# Altium schematic sheet LTEW_nRF9160.SchDoc: LTEW_nRF9160
size 420 x 297 mm; Organization: MSE HES-SO; Address1: HEVS; Address3: Tristan Traiber; DocumentNumber: 2; Revision: 1.0; SheetNumber: 2; SheetTotal: 6; Author: Tristan Traiber; DrawnBy: Tristan Traiber; Engineer: Tristan Traiber; DocumentSize: A3
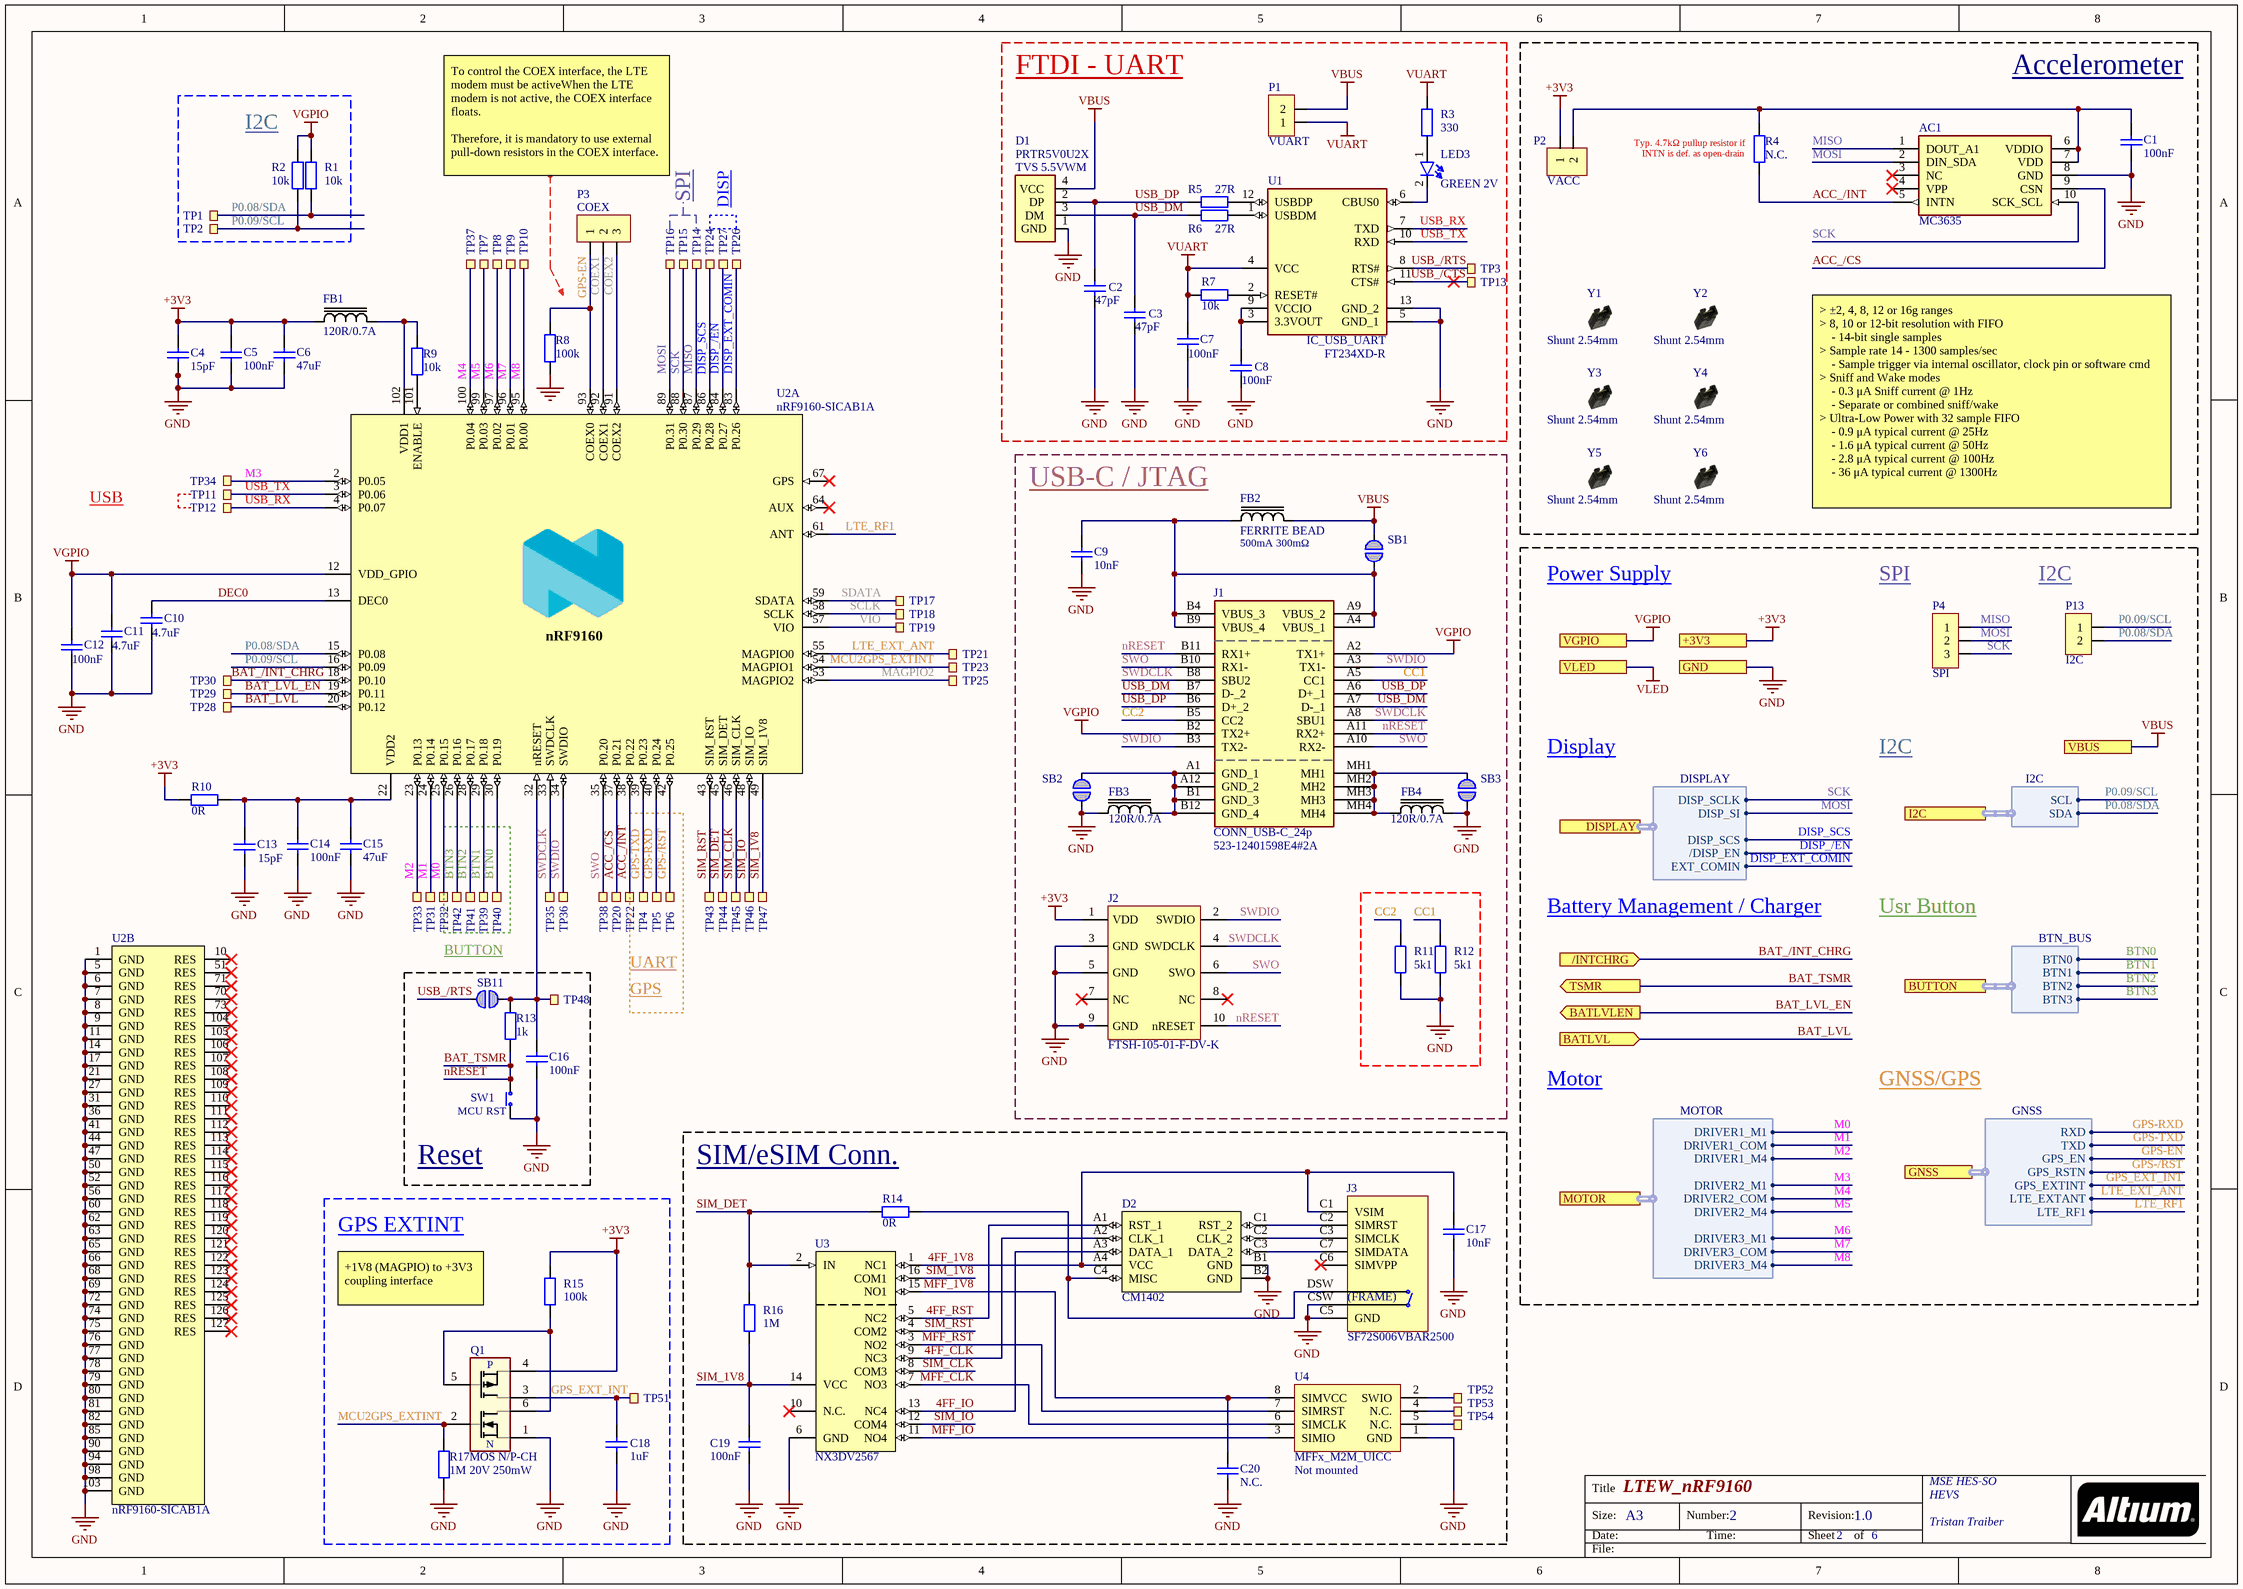
[diagram p0: LTEW_nRF9160.SchDoc]

## Parts
AC1  MC3635  [MC3635]
C1  100nF  [C0603]
C2  47pF  [C0603]
C3  47pF  [C0603]
C4  15pF  [C0603]
C5  100nF  [C0603]
C6  47uF  [CAPC2012X11L]
C7  100nF  [C0603]
C8  100nF  [C0603]
C9  10nF  [C0603]
C10  4.7uF  [C0603]
C11  4.7uF  [C0603]
C12  100nF  [C0603]
C13  15pF  [C0603]
C14  100nF  [C0603]
C15  47uF  [CAPC2012X11L]
C16  100nF  [C0603]
C17  10nF  [C0603]
C18  1uF  [C0603]
C19  100nF  [C0603]
C20  N.C.  [C0603]
D1  TVS 5.5VWM  [PRTR5V0U2X]
D2  CM1402  [CM1402]
FB1  120R/0.7A  [INDC1005X04L]
FB2  FERRITE BEAD  value 500mA 300mΩ  [BEADC2012X110N]
FB3  120R/0.7A  [INDC1005X04L]
FB4  120R/0.7A  [INDC1005X04L]
J1  CONN_USB-C_24p  Supplier Part Number 1: 523-12401598E4#2A  [12401598E42A - JTAG]
J2  FTSH-105-01-F-DV-K  [HDR_2x5-SMD-1.27mm-K]
J3  SF72S006VBAR2500  [SF72S006VBAR2500]
LED3  GREEN 2V  [LEDC1608X80N]
P1  VUART  [HDR1X2 - UART]
P2  VACC  [HDR1X2 - ACCEL]
P3  COEX  [HDR1X3 - COEX]
P4  SPI  [HDR1X3 - SPI]
P13  I2C  [HDR1X2 - I2C]
Q1  MOS N/P-CH  value 20V 250mW  [SOT50P160X60-6N]
R1  10k  [RES0603]
R2  10k  [RES0603]
R3  330  [RES0603]
R4  N.C.  [RES0603]
R5  27R  [RES0603]
R6  27R  [RES0603]
R7  10k  [RES0603]
R8  100k  [RES0603]
R9  10k  [RES0603]
R10  0R  [RESC2012X60N]
R11  5k1  [RES0603]
R12  5k1  [RES0603]
R13  1k  [RES0603]
R14  0R  [RESC2012X60N]
R15  100k  [RES0603]
R16  1M  [RES0603]
R17  1M  [RES0603]
SB1  Solderbridge  [Solderbridge]  (value not drawn)  (no BOM)
SB2  Solderbridge  [Solderbridge]  (value not drawn)  (no BOM)
SB3  Solderbridge  [Solderbridge]  (value not drawn)  (no BOM)
SB11  Solderbridge  [Solderbridge]  (value not drawn)  (no BOM)
SW1  value MCU RST  [Push Button C2.5X3.0 OMRON B3U-1000P(M)-B - MCU RST]  (hidden comment: SKHUALE010)
TP1  Ø1.0mm,SMD  [TP_SMD_Ø0.8mm]  (value not drawn)  (no BOM)
TP2  Ø1.0mm,SMD  [TP_SMD_Ø0.8mm]  (value not drawn)  (no BOM)
TP3  Ø1.0mm,SMD  [TP_SMD_Ø0.8mm]  (value not drawn)  (no BOM)
TP4  Ø1.0mm,SMD  [TP_SMD_Ø0.8mm]  (value not drawn)  (no BOM)
TP5  Ø1.0mm,SMD  [TP_SMD_Ø0.8mm]  (value not drawn)  (no BOM)
TP6  Ø1.0mm,SMD  [TP_SMD_Ø0.8mm]  (value not drawn)  (no BOM)
TP7  Ø1.0mm,SMD  [TP_SMD_Ø0.8mm]  (value not drawn)  (no BOM)
TP8  Ø1.0mm,SMD  [TP_SMD_Ø0.8mm]  (value not drawn)  (no BOM)
TP9  Ø1.0mm,SMD  [TP_SMD_Ø0.8mm]  (value not drawn)  (no BOM)
TP10  (no value)  [TP_SMD_Ø0.8mm]  (no BOM)
TP11  Ø1.0mm,SMD  [TP_SMD_Ø0.8mm]  (value not drawn)  (no BOM)
TP12  Ø1.0mm,SMD  [TP_SMD_Ø0.8mm]  (value not drawn)  (no BOM)
TP13  Ø1.0mm,SMD  [TP_SMD_Ø0.8mm]  (value not drawn)  (no BOM)
TP14  Ø1.0mm,SMD  [TP_SMD_Ø0.8mm]  (value not drawn)  (no BOM)
TP15  Ø1.0mm,SMD  [TP_SMD_Ø0.8mm]  (value not drawn)  (no BOM)
TP16  Ø1.0mm,SMD  [TP_SMD_Ø0.8mm]  (value not drawn)  (no BOM)
TP17  Ø1.0mm,SMD  [TP_SMD_Ø0.8mm]  (value not drawn)  (no BOM)
TP18  Ø1.0mm,SMD  [TP_SMD_Ø0.8mm]  (value not drawn)  (no BOM)
TP19  Ø1.0mm,SMD  [TP_SMD_Ø0.8mm]  (value not drawn)  (no BOM)
TP20  Ø1.0mm,SMD  [TP_SMD_Ø0.8mm]  (value not drawn)  (no BOM)
TP21  Ø1.0mm,SMD  [TP_SMD_Ø0.8mm]  (value not drawn)  (no BOM)
TP22  Ø1.0mm,SMD  [TP_SMD_Ø0.8mm]  (value not drawn)  (no BOM)
TP23  Ø1.0mm,SMD  [TP_SMD_Ø0.8mm]  (value not drawn)  (no BOM)
TP24  Ø1.0mm,SMD  [TP_SMD_Ø0.8mm]  (value not drawn)  (no BOM)
TP25  Ø1.0mm,SMD  [TP_SMD_Ø0.8mm]  (value not drawn)  (no BOM)
TP26  Ø1.0mm,SMD  [TP_SMD_Ø0.8mm]  (value not drawn)  (no BOM)
TP27  Ø1.0mm,SMD  [TP_SMD_Ø0.8mm]  (value not drawn)  (no BOM)
TP28  Ø1.0mm,SMD  [TP_SMD_Ø0.8mm]  (value not drawn)  (no BOM)
TP29  Ø1.0mm,SMD  [TP_SMD_Ø0.8mm]  (value not drawn)  (no BOM)
TP30  Ø1.0mm,SMD  [TP_SMD_Ø0.8mm]  (value not drawn)  (no BOM)
TP31  Ø1.0mm,SMD  [TP_SMD_Ø0.8mm]  (value not drawn)  (no BOM)
TP32  Ø1.0mm,SMD  [TP_SMD_Ø0.8mm]  (value not drawn)  (no BOM)
TP33  Ø1.0mm,SMD  [TP_SMD_Ø0.8mm]  (value not drawn)  (no BOM)
TP34  Ø1.0mm,SMD  [TP_SMD_Ø0.8mm]  (value not drawn)  (no BOM)
TP35  Ø1.0mm,SMD  [TP_SMD_Ø0.8mm]  (value not drawn)  (no BOM)
TP36  Ø1.0mm,SMD  [TP_SMD_Ø0.8mm]  (value not drawn)  (no BOM)
TP37  Ø1.0mm,SMD  [TP_SMD_Ø0.8mm]  (value not drawn)  (no BOM)
TP38  Ø1.0mm,SMD  [TP_SMD_Ø0.8mm]  (value not drawn)  (no BOM)
TP39  Ø1.0mm,SMD  [TP_SMD_Ø0.8mm]  (value not drawn)  (no BOM)
TP40  Ø1.0mm,SMD  [TP_SMD_Ø0.8mm]  (value not drawn)  (no BOM)
TP41  Ø1.0mm,SMD  [TP_SMD_Ø0.8mm]  (value not drawn)  (no BOM)
TP42  Ø1.0mm,SMD  [TP_SMD_Ø0.8mm]  (value not drawn)  (no BOM)
TP43  Ø1.0mm,SMD  [TP_SMD_Ø0.8mm]  (value not drawn)  (no BOM)
TP44  Ø1.0mm,SMD  [TP_SMD_Ø0.8mm]  (value not drawn)  (no BOM)
TP45  Ø1.0mm,SMD  [TP_SMD_Ø0.8mm]  (value not drawn)  (no BOM)
TP46  Ø1.0mm,SMD  [TP_SMD_Ø0.8mm]  (value not drawn)  (no BOM)
TP47  Ø1.0mm,SMD  [TP_SMD_Ø0.8mm]  (value not drawn)  (no BOM)
TP48  Ø1.0mm,SMD  [TP_SMD_Ø0.8mm]  (value not drawn)  (no BOM)
TP51  Ø1.0mm,SMD  [TP_SMD_Ø0.8mm]  (value not drawn)  (no BOM)
TP52  Ø1.0mm,SMD  [TP_SMD_Ø0.8mm]  (value not drawn)  (no BOM)
TP53  Ø1.0mm,SMD  [TP_SMD_Ø0.8mm]  (value not drawn)  (no BOM)
TP54  Ø1.0mm,SMD  [TP_SMD_Ø0.8mm]  (value not drawn)  (no BOM)
U1  IC_USB_UART  Manufacturer_Part_Number: FT234XD-R  [SON45P300X300X75-13N-D]
U2  nRF9160-SICAB1A  [LGA50P1600X1050X104-161N]  (parts A,B of 2)
U3  NX3DV2567  [XQFN40P180X260X50-16N]
U4  MFFx_M2M_UICC  Assembly: Not mounted  [SON127P600X90_HS-8N]
Y1  Shunt 2.54mm  [Shunt_2.54mm_Horizontal]
Y2  Shunt 2.54mm  [Shunt_2.54mm_Horizontal]
Y3  Shunt 2.54mm  [Shunt_2.54mm_Horizontal]
Y4  Shunt 2.54mm  [Shunt_2.54mm_Horizontal]
Y5  Shunt 2.54mm  [Shunt_2.54mm_Horizontal]
Y6  Shunt 2.54mm  [Shunt_2.54mm_Horizontal]

## Blocks framed on the sheet
FTDI - UART: C2 C3 C7 C8 D1 LED3 P1 R3 R5-R7 TP3 TP13 U1
Accelerometer: AC1 C1 P2 R4 Y1-Y6
I2C: R1 R2 TP1 TP2
USB-C / JTAG: C9 FB2-FB4 J1 J2 R11 R12 SB1-SB3
Reset: C16 R13 SB11 SW1 TP48
SIM/eSIM Conn.: C17 C19 C20 D2 J3 R14 R16 TP52-TP54 U3 U4
GPS EXTINT: C18 Q1 R15 R17 TP51

## Ports
+3V3, /INTCHRG (in), BATLVL (in), BATLVLEN (out), BUTTON (harness BTN_BUS), DISPLAY (harness DISPLAY), GND, GNSS (harness GNSS), I2C (harness I2C), MOTOR (harness MOTOR), TSMR (out), VBUS, VGPIO, VLED

## Harnesses
I2C: SCL, SDA
BTN_BUS: BTN0, BTN1, BTN2, BTN3
GNSS: RXD, TXD, LTE_EXTANT, GPS_EN, LTE_RF1, GPS_RSTN, GPS_EXTINT
DISPLAY: DISP_SCLK, DISP_SCS, DISP_SI, /DISP_EN, EXT_COMIN
MOTOR: DRIVER1_M1, DRIVER1_COM, DRIVER2_M1, DRIVER2_COM, DRIVER2_M4, DRIVER3_M1, DRIVER3_COM, DRIVER3_M4, DRIVER1_M4

## Nets
+3V3: C4.2 C5.2 C6.2 FB1.1 J2.1(VDD) P2.1 Q1.4(S2) R10.1 R15.2 ; port +3V3
GND: AC1.8(GND) C1.1 C2.1 C3.1 C4.1 C5.1 C6.1 C7.1 C8.1 C9.1 C10.1 C11.1 C12.1 C13.1 C14.1 C15.1 C16.1 C17.1 C18.1 C19.1 C20.1 D1.1(GND) D2.B1(GND) D2.B2(GND) FB3.1 FB4.2 J2.3(GND) J2.5(GND) J2.9(GND) J3.0(GND) J3.C5(GND) J3.CSW Q1.1(S1) R8.1 R11.2 R12.2 R17.1 SB2.1 SB3.1 SW1.2(COM) U1.5(GND_1) U1.13(GND_2) U2.1(GND) U2.5(GND) U2.6(GND) U2.7(GND) U2.8(GND) U2.9(GND) U2.11(GND) U2.14(GND) U2.17(GND) U2.21(GND) U2.27(GND) U2.31(GND) U2.36(GND) U2.41(GND) U2.44(GND) U2.47(GND) U2.50(GND) U2.52(GND) U2.56(GND) U2.60(GND) U2.62(GND) U2.63(GND) U2.65(GND) U2.66(GND) U2.68(GND) U2.69(GND) U2.72(GND) U2.74(GND) U2.75(GND) U2.76(GND) U2.77(GND) U2.78(GND) U2.79(GND) U2.80(GND) U2.81(GND) U2.82(GND) U2.85(GND) U2.90(GND) U2.94(GND) U2.98(GND) U2.103(GND) U3.6(GND) U4.1(GND) ; port GND
VBUS: D1.4(VCC) FB2.2 P1.2 SB1.2 ; port VBUS
VGPIO: C11.2 C12.2 J1.A2(TX1+) J1.B2(TX2+) R1.2 R2.2 U2.12(VDD_GPIO) ; port VGPIO
VLED: port VLED
VUART: C7.2 P1.1 R3.2 R7.2 U1.4(VCC)
4FF_1V8: C17.2 D2.A4(VCC) J3.C1(VSIM) U3.1(NC1)
4FF_CLK: D2.A2(CLK_1) U3.9(NC3)
4FF_IO: D2.A3(DATA_1) U3.13(NC4)
4FF_RST: D2.A1(RST_1) U3.5(NC2)
ACC_/CS: AC1.9(CSN) TP20.1 U2.37(P0.21)
ACC_/INT: AC1.5(INTN) R4.1 TP22.1 U2.38(P0.22)
BAT_/INT_CHRG: TP30.1 U2.18(P0.10) ; port /INTCHRG
BAT_LVL: TP28.1 U2.20(P0.12) ; port BATLVL
BAT_LVL_EN: TP29.1 U2.19(P0.11) ; port BATLVLEN
BAT_TSMR: J1.A11(RX2+) J1.B11(RX1+) J2.10(nRESET) R13.2 SW1.1(N.O) ; port TSMR  [also labelled nRESET]
BTN0: TP40.1 U2.30(P0.19) ; port BUTTON.BTN0
BTN1: TP39.1 U2.29(P0.18) ; port BUTTON.BTN1
BTN2: TP41.1 U2.28(P0.17) ; port BUTTON.BTN2
BTN3: TP42.1 U2.26(P0.16) ; port BUTTON.BTN3
CC1: J1.A5(CC1) R12.1
CC2: J1.B5(CC2) R11.1
COEX1: P3.2 U2.92(COEX1)
COEX2: P3.3 U2.91(COEX2)
DEC0: C10.2 U2.13(DEC0)
DISP_/EN: TP27.1 U2.84(P0.27) ; port DISPLAY./DISP_EN
DISP_EXT_COMIN: TP26.1 U2.83(P0.26) ; port DISPLAY.EXT_COMIN
DISP_SCS: TP24.1 U2.86(P0.28) ; port DISPLAY.DISP_SCS
GPS-/RST: TP6.1 U2.42(P0.25) ; port GNSS.GPS_RSTN
GPS-EN: P3.1 R8.2 U2.93(COEX0) ; port GNSS.GPS_EN
GPS-RXD: TP5.1 U2.40(P0.24) ; port GNSS.RXD
GPS-TXD: TP4.1 U2.39(P0.23) ; port GNSS.TXD
GPS_EXT_INT: C18.2 Q1.3(D2) TP51.1 ; port GNSS.GPS_EXTINT
LTE_EXT_ANT: TP21.1 U2.55(MAGPIO0) ; port GNSS.LTE_EXTANT
LTE_RF1: U2.61(ANT) ; port GNSS.LTE_RF1
M0: TP32.1 U2.25(P0.15) ; port MOTOR.DRIVER1_M1
M1: TP31.1 U2.24(P0.14) ; port MOTOR.DRIVER1_COM
M2: TP33.1 U2.23(P0.13) ; port MOTOR.DRIVER1_M4
M3: TP34.1 U2.2(P0.05) ; port MOTOR.DRIVER2_M1
M4: TP37.1 U2.100(P0.04) ; port MOTOR.DRIVER2_COM
M5: TP7.1 U2.99(P0.03) ; port MOTOR.DRIVER2_M4
M6: TP8.1 U2.97(P0.02) ; port MOTOR.DRIVER3_M1
M7: TP9.1 U2.96(P0.01) ; port MOTOR.DRIVER3_COM
M8: TP10.1 U2.95(P0.00) ; port MOTOR.DRIVER3_M4
MAGPIO2: TP25.1 U2.53(MAGPIO2)
MCU2GPS_EXTINT: Q1.2(G1) R17.2 TP23.1 U2.54(MAGPIO1)
MFF_1V8: C20.2 U3.15(NO1) U4.8(SIMVCC)
MFF_CLK: U3.7(NO3) U4.6(SIMCLK)
MFF_IO: U3.11(NO4) U4.3(SIMIO)
MFF_RST: U3.3(NO2) U4.7(SIMRST)
MISO: AC1.1(DOUT_A1) P4.1 TP14.1 U2.87(P0.29)
MOSI: AC1.2(DIN_SDA) P4.2 TP16.1 U2.89(P0.31) ; port DISPLAY.DISP_SI
P0.08/SDA: P13.2 R1.1 TP1.1 U2.15(P0.08) ; port I2C.SDA
P0.09/SCL: P13.1 R2.1 TP2.1 U2.16(P0.09) ; port I2C.SCL
SCK: AC1.10(SCK_SCL) P4.3 TP15.1 U2.88(P0.30) ; port DISPLAY.DISP_SCLK
SCLK: TP18.1 U2.58(SCLK)
SDATA: TP17.1 U2.59(SDATA)
SIM_1V8: C19.2 R16.1 TP47.1 U2.49(SIM_1V8) U3.14(VCC) U3.16(COM1)
SIM_CLK: TP45.1 U2.46(SIM_CLK) U3.8(COM3)
SIM_DET: R14.1 R16.2 TP44.1 U2.45(SIM_DET) U3.2(IN)
SIM_IO: TP46.1 U2.48(SIM_IO) U3.12(COM4)
SIM_RST: TP43.1 U2.43(SIM_RST) U3.4(COM2)
SWDCLK: J1.A8(SBU1) J1.B8(SBU2) J2.4(SWDCLK) TP35.1 U2.33(SWDCLK)
SWDIO: J1.A3(TX1-) J1.B3(TX2-) J2.2(SWDIO) TP36.1 U2.34(SWDIO)
SWO: J1.A10(RX2-) J1.B10(RX1-) J2.6(SWO) TP38.1 U2.35(P0.20)
USB_/CTS: TP13.1 U1.11(CTS#)
USB_/RTS: SB11.2 TP3.1 U1.8(RTS#)
USB_DM: C3.2 D1.3(DM) J1.A7(D-_1) J1.B7(D-_2) R6.1
USB_DP: C2.2 D1.2(DP) J1.A6(D+_1) J1.B6(D+_2) R5.1
USB_RX: TP12.1 U1.7(TXD) U2.4(P0.07)
USB_TX: TP11.1 U1.10(RXD) U2.3(P0.06)
VIO: TP19.1 U2.57(VIO)
NetAC1_6: AC1.6(VDDIO) AC1.7(VDD) C1.2 P2.2 R4.2
NetC8_2: C8.2 U1.3(3.3VOUT) U1.9(VCCIO)
NetC9_2: C9.2 FB2.1 J1.A4(VBUS_1) J1.A9(VBUS_2) J1.B4(VBUS_3) J1.B9(VBUS_4) SB1.1
NetC13_2: C13.2 C14.2 C15.2 R10.2 U2.22(VDD2)
NetC16_2: C16.2 R13.1 SB11.1 TP48.1 U2.32(nRESET)
NetD2_C1: D2.C1(RST_2) J3.C2(SIMRST)
NetD2_C2: D2.C2(CLK_2) J3.C3(SIMCLK)
NetD2_C3: D2.C3(DATA_2) J3.C7(SIMDATA)
NetD2_C4: D2.C4(MISC) J3.DSW R14.2
NetFB1_2: FB1.2 R9.2 U2.102(VDD1)
NetFB3_2: FB3.2 J1.A1(GND_1) J1.A12(GND_2) J1.B1(GND_3) J1.B12(GND_4) SB2.2
NetFB4_1: FB4.1 J1.MH1 J1.MH2 J1.MH3 J1.MH4 SB3.2
NetLED3_1: LED3.1(A) R3.1
NetLED3_2: LED3.2(K) U1.6(CBUS0)
NetQ1_5: Q1.5(G2) Q1.6(D1) R15.1
NetR5_2: R5.2 U1.12(USBDP)
NetR6_2: R6.2 U1.1(USBDM)
NetR7_1: R7.1 U1.2(RESET#)
NetR9_1: R9.1 U2.101(ENABLE)
NetTP52_1: TP52.1 U4.2(SWIO)
NetTP53_1: TP53.1 U4.4(N.C.)
NetTP54_1: TP54.1 U4.5(N.C.)

Not connected (* = marked no-connect by the designer): AC1 3(NC)* 4(VPP)*; J2 7(NC)* 8(NC)*; J3 C6(SIMVPP)*; U2 10(RES)* 51(RES)* 64(AUX)* 67(GPS)* 70(RES)* 71(RES)* 73(RES)* 104(RES)* 105(RES)* 106(RES)* 107(RES)* 108(RES)* 109(RES)* 110(RES)* 111(RES)* 112(RES)* 113(RES)* 114(RES)* 115(RES)* 116(RES)* 117(RES)* 118(RES)* 119(RES)* 120(RES)* 121(RES)* 122(RES)* 123(RES)* 124(RES)* 125(RES)* 126(RES)* 127(RES)*; U3 10(N.C.)*

## Notes on the sheet
- To control the COEX interface, the LTE modem must be activeWhen the LTE modem is not active, the COEX interface floats.
  Therefore, it is mandatory to use external pull-down resistors in the COEX interface.
- DISP
- (near R4) Typ. 4.7kΩ pullup resistor if INTN is def. as open-drain
- SPI
- USB
- > ±2, 4, 8, 12 or 16g ranges
  > 8, 10 or 12-bit resolution with FIFO
  - 14-bit single samples
  > Sample rate 14 - 1300 samples/sec
  - Sample trigger via internal oscillator, clock pin or software cmd
  > Sniff and Wake modes
  - 0.3 μA Sniff current @ 1Hz
  - Separate or combined sniff/wake
  > Ultra-Low Power with 32 sample FIFO
  - 0.9 μA typical current @ 25Hz
  - 1.6 μA typical current @ 50Hz
  - 2.8 μA typical current @ 100Hz
  - 36 μA typical current @ 1300Hz
- Power Supply
- (near P13) I2C
- Display
- I2C
- Battery Management / Charger
- Usr Button
- BUTTON
- UART
- GPS
- Motor
- GNSS/GPS
- +1V8 (MAGPIO) to +3V3 coupling interface
- Title
- Size:
- Date:
- A3
- Number:
- Time:
- Revision:
- Sheet
- of
- File:
- (in symbol C_47p) /
- (in symbol MCU_nRF9160-SICAB1A, part A) nRF9160
- (in symbol MOS_NP_3) P; N
- (in symbol SF72S006VBAR2500) (FRAME)

## Library data of the parts
AC1 = IC_ACCEL: Accéléromètres X, Y, Z Axis ±2g, 4g, 8g, 12g, 16g 10-LGA (1,6x1,6); Manufacturer_Name: Memsic Inc.; Datasheet Link: http://www.mcubemems.com/wp-content/uploads/2017/09/MC3635-Datasheet-APS-048-0044v1.5.pdf; Height: 0.94mm; Manufacturer_Part_Number: MC3635; Supplier 1: Mouser; Supplier Part Number 1: 498-MC3635; Unit Price: 2.52
C1 C5 C7 C8 C12 C14 C16 C19 = C_100n: 0.1 µF ±10% 25V Condensateurs céramique X7R 0603 (1608 métrique); Manufacturer_Part_Number: CL10B104KA8NNNC; Manufacturer_Name: Samsung Electro-Mechanics; Supplier 1: Digi-Key; Value: 100nF; Supplier Part Number 1: 1276-1006-1-ND; Unit Price: 0.10
C2 C3 = C_47p: 47 pF ±5% 25V Ceramic Capacitor C0G, NP0 0603 (1608 Metric); Manufacturer_Part_Number: C0603C470J3GAC7867; Manufacturer_Name: KEMET; Value: 47pF; Supplier 1: Digi-Key; Supplier Part Number 1: 399-C0603C470J3GAC7867CT-ND; Unit Price: 0.130
C4 C13 = C_15p: 15 pF ±5% 25V Ceramic Capacitor C0G, NP0 0603 (1608 Metric); Manufacturer_Part_Number: 06033A150JAT2A; Manufacturer_Name: KYOCERA AVX; Value: 15pF; Supplier 1: Digi-Key; Supplier Part Number 1: 478-10804-1-ND
C6 C15 = C_47u: 47 µF ±20% 10V Ceramic Capacitor X5R 0805 (2012 Metric); Manufacturer_Part_Number: GRM21BR61A476ME15L; Manufacturer_Name: Murata Electronics; Value: 47uF; Supplier 1: Digi-Key; Supplier Part Number 1: 490-9961-1-ND; Unit Price: 0.66
C9 C17 = C_10n: 10000 pF ±5% 25V Condensateurs céramique C0G, NP0 0603 (1608 métrique); Manufacturer_Part_Number: C1608C0G1E103J080AA; Manufacturer_Name: TDK Corporation; Value: 10nF; Supplier 1: Digi-Key; Supplier Part Number 1: 445-2664-1-ND; Unit Price: 0.270
C10 C11 = C_4.7u: 4.7 µF ±10% 25V Condensateurs céramique X6S 0603 (1608 métrique); Manufacturer_Part_Number: GRM188C81E475KE11D; Manufacturer_Name: Murata Electronics; Supplier 1: Digi-Key; Value: 4.7uF; Supplier Part Number 1: 490-7199-1-ND; Unit Price: 0.24
C18 = C_1u: 1 µF ±10% 25V Ceramic Capacitor X7R 0603 (1608 Metric); Manufacturer_Part_Number: CL10B105KA8NNNC; Manufacturer_Name: Samsung Electro-Mechanics; Supplier 1: Mouser; Supplier Part Number 1: 187-CL10B105KA8NNNC; Value: 1uF; Price Unit: 0.10
C20 = C_NC: NC; Value: N.C.
D1 = D_TVS_USB: Clamp Ipp Tvs Diode Surface Mount SOT-143B; Manufacturer_Name: Nexperia; Datasheet Link: https://assets.nexperia.com/documents/data-sheet/PRTR5V0U2X.pdf; Height: 1.1mm; Supplier 1: Digi-Key; Supplier Part Number 1: 1727-3884-1-ND; Manufacturer_Part_Number: PRTR5V0U2X; Unit Price: 0.52
D2 = CM1402: EMI Network Filter Arrays SIM CARD EMI FILTER WITH ESD PROTECTION; Manufacturer: ON Semiconductor; Manufacturer Part Number: CM1402-03CP; Part number IPS: 00000009949; Note: N.A.; Pad Count: 10; Part Number: CM1402; Footprint Doc: CM1402; LatestRevisionDate: 2017-02-06; Published: 2017-02-06; Value: CM1402; Artikkelnr Noca: N.A.; ComponentLink1URL: N.A.; ComponentLink1Description: Datasheet; ComponentLink2URL: N.A.; ComponentLink2Description: Supplier link; HelpURL: http://www.onsemi.com/pub_link/Collateral/CM1402-D.PDF; Supplier 1: Digi-Key; Supplier Part Number 1: CM1402-03CPOSTR-ND; Supplier 2: Mouser; Supplier Part Number 2: 748-CM1402-03CP; PartId: 101300139; Component Class: Semiconductors
FB1 FB3 FB4 = L_FerritBead_MCU: Ferrite Bead, 120 Ohm @ 100MHz, 700mA, 130 mOhm Max; Manufacturer Part Number: BLM15AX121SN1; Manufacturer_Name: Murata; ComponentLink1URL: https://www.murata.com/en-us/products/productdata/8796740059166/ENFA0018.pdf; ComponentLink1Description: Datasheet; ComponentLink2URL: N.A.; ComponentLink2Description: Supplier link; HelpURL: https://www.murata.com/products/productdetail?partno=BLM15AX121SN1%23; Footprint Doc: 0402; Value: 120R/0.7A; Supplier 1: Digi-Key; Supplier Part Number 1: 490-5439-1-ND; Unit Price: 0.10
FB2 = L_FerritBead: 600 Ohms @ 100 MHz 1 Power, Signal Line Ferrite Bead 0805 (2012 Metric) 500mA 300mOhm; Manufacturer_Name: Laird Performance Materials; Manufacturer_Part_Number: HZ0805E601R-10; Datasheet Link: https://www.laird.com/sites/default/files/hz0805e601r-10-datasheet.pdf; Height: 1.1mm; Supplier 1: Digi-Key; Supplier Part Number 1: 240-2399-1-ND; Unit Price: 0.19
J1 = CONN_USB-C_24p: USB-C (USB TYPE-C) USB 3.2 Gen 2 (USB 3.1 Gen 2, Superspeed + (USB 3.1)) Receptacle Connector 24 Position Surface Mount, Right Angle; Through Hole; Manufacturer_Part_Number: 12401598E4#2A; Manufacturer: Amphenol Communication Solutions; Datasheet Link: https://cdn.amphenol-icc.com/media/wysiwyg/files/drawing/12401598xxx2a.pdf; Height: 3.43mm; Supplier 1: Mouser; Unit Price: 1.61
J2 = JTAG: Connector Header Surface Mount 10 position 0.050" (1.27mm); Manufacturer_Name: Samtec Inc.; Value: FTSH-105-01-F-DV-K; Supplier 1: Digi-Key; Manufacturer_Part_Number: FTSH-105-01-F-DV-K; Supplier Part Number 1: SAM8796-ND; Unit Price: 4.00
J3 = SF72S006VBAR2500: n 8 (6 + 2) Position Card Connector NANO SIM Surface Mount, Right Angle Gold; Manufacturer Part Number: SF72S006VBDR2500; Manufacturer_Name: JAE Electronics; ComponentLink1URL: N.A.; ComponentLink1Description: Datasheet; ComponentLink2URL: N.A.; ComponentLink2Description: Supplier link; Supplier 1: Digi-Key; Supplier Part Number 1: 670-2967-6-ND
LED3 = LED_G: Green 570nm LED Indication - Discrete 2V 0603 (1608 Metric); Manufacturer_Name: QT Brightek (QTB); Manufacturer_Part_Number: 150060VS75000; Datasheet Link: http://www.qt-brightek.com/datasheet/QBLP617_series.pdf; Height: 1.3mm; Supplier 1: Digi-Key; Supplier Part Number 1: 732-4980-1-ND; Unit Price: 0.15
P1 P2 P13 = H_2POS: Header, 2-Pin; Manufacturer_Part_Number: 10129378-902001BLF; Manufacturer_Name: Amphenol ICC (FCI); Supplier 1: Mouser; Supplier Part Number 1: 649-1012937890201BLF; Unit Price: 0.10
P3 P4 = H_1x3: Header, 3-Pin; Manufacturer_Name: Harwin Inc.; Manufacturer_Part_Number: M20-9990345; Publisher: Altium Limited; Supplier 1: Digi-key; Supplier Part Number 1: 952-2263-ND; Unit Price: 0.17
Q1 = MOS_NP_3: Mosfet Array N and P-Channel 20V 485mA, 370mA 250mW Surface Mount SC-89 (SOT-563F); Manufacturer_Name: Vishay; Manufacturer_Part_Number: SI1016X-T1-GE3; Datasheet Link: https://componentsearchengine.com/Datasheets/1/SI1016X-T1-GE3.pdf; Height: 0.6mm; Supplier 1: Digi-Key; Supplier Part Number 1: SI1016X-T1-GE3CT-ND; Unit Price: 0.48
R1 R2 R7 R9 = R_10k: 10 kOhms ±1% 0.1W, 1/10W Chip Resistor 0603 (1608 Metric) Moisture Resistant Thick Film; Manufacturer_Part_Number: RC0805FR-0710KL; Manufacturer_Name: YAGEO; Supplier 1: Digi-Key; Supplier Part Number 1: 311-10.0KHRCT-ND; Value: 10k; Unit Price: 0..10
R3 = R_330: 330 Ohms ±1% 0.1W, 1/10W Chip Resistor 0603 (1608 Metric) Automotive AEC-Q200 Thick Film; Manufacturer_Part_Number: CR0603-FX-3300ELF; Manufacturer_Name: YAGEO; Value: 330; Supplier 1: Digi-Key; Supplier Part Number 1: CR0603-FX-3300ELFCT-ND; Unit Price: 0.10
R4 = R_NC: Value: N.C.
R5 R6 = R_27: 27 Ohms ±1% 0.1W, 1/10W Chip Resistor 0603 (1608 Metric) Automotive AEC-Q200 Thick Film; Manufacturer_Part_Number: ERJ-3EKF27R0V; Manufacturer_Name: YAGEO; Value: 27R; Supplier 1: Digi-Key; Supplier Part Number 1: P27.0HCT-ND; Unit Price: 0.10
R8 R15 = R_100k: RES SMD 100K OHM 1% 1/8W 0603; Manufacturer_Part_Number: RC0805FR-07100KL; Manufacturer_Name: YAGEO; Supplier 1: Digi-Key; Supplier Part Number 1: 311-100KCRCT-ND; Value: 100k; Unit Price: 0.10
R10 R14 = R_0: 0 Ohms Jumper 0.1W, 1/10W Chip Resistor 0603 (1608 Metric) Moisture Resistant Thick Film; Manufacturer_Part_Number: RC0603JR-070RL; Manufacturer_Name: YAGEO; Supplier 1: Digi-Key; Supplier Part Number 1: 311-0.0GRCT-ND; Value: 0R; Unit Price: 0.10
R11 R12 = R_5k1: 5.1 kOhms ±1% 0.1W, 1/10W Chip Resistor 0603 (1608 Metric) Moisture Resistant Thick Film; Manufacturer_Part_Number: RC0603FR-075K1L; Manufacturer_Name: YAGEO; Value: 5k1; Supplier 1: Digi-Key; Supplier Part Number 1: 311-5.10KHRDKR-ND; Unit Price: 0.10
R13 = R_1k: 1 kOhms ±1% 0.1W, 1/10W Chip Resistor 0603 (1608 Metric) Moisture Resistant Thick Film; Manufacturer_Part_Number: RC0603FR-071KL; Manufacturer_Name: YAGEO; Value: 1k; Supplier 1: Digi-Key; Supplier Part Number 1: 311-1.00KHRCT-ND; Unit Price: 0.10
R16 R17 = R_1M: 1 MOhms ±1% 0.1W, 1/10W Chip Resistor 0603 (1608 Metric) Automotive AEC-Q200 Thick Film; Manufacturer_Part_Number: ERJ-3EKF1004V; Manufacturer_Name: YAGEO; Value: 1M; Supplier 1: Digi-Key; Supplier Part Number 1: P1.00MHCT-ND; Unit Price: 0.10
SB1-SB3 SB11 = Solderbridge: Manufacturer: N.A.; Pad Count: 2; Part Number: Solderbridge; Manufacturer Part Number: N.A.; LatestRevisionDate: 2009-12-14; Published: 2009-12-14; Value: Solderbridge; Note: N.A.; Artikkelnr Noca: N.A.; Footprint Doc: Solderbridge; Part number IPS: N.A.; ComponentLink1URL: N.A.; ComponentLink1Description: Datasheet; ComponentLink2URL: N.A.; ComponentLink2Description: Supplier link; HelpURL: N.A.; Supplier 1: N.A.; Supplier Part Number 1: N.A.; Supplier 2: N.A.; Supplier Part Number 2: N.A.; PartId: 100500458; Component Class: Connectors
SW1 = SW_SMD_PB: Tactile Switch, SPNO, SMD, 160gf, 6.2x6.3x2.5mm; Manufacturer_Name: Alps Alpine; Pad Count: 4; ComponentLink1URL: N.A.; ComponentLink1Description: Datasheet; ComponentLink2URL: N.A.; ComponentLink2Description: Supplier link; Supplier Part Number 2: 1333652; PartId: 101500001; Component Class: Switches; Supplier 1: Mouser; Supplier Part Number 1: 688-SKHUALE010; Manufacturer_Part_Number: SKHUALE010; Unit Price: 0.76; Supplier 2: Farnell
TP1-TP9 TP11-TP48 TP51-TP54 = TP_SMD: 0.8 mm circular SMD testpad; Part Number: TP_SMD_Ø1.0MM; Manufacturer: Nordic Semiconductor; Manufacturer Part Number: N.A.; Pad Count: 1; ComponentLink1URL: N.A.; ComponentLink1Description: Datasheet; ComponentLink2URL: N.A.; ComponentLink2Description: Supplier link; HelpURL: N.A.; Footprint Doc: TP_SMD_Ø1.0mm; LatestRevisionDate: 2013-06-11; Published: 2013-06-11; Value: Ø1.0mm,SMD; Note: N.A.; Supplier 1: N.A.; Supplier Part Number 1: N.A.; Supplier 2: N.A.; Supplier Part Number 2: N.A.; Artikkelnr Noca: N.A.; Part number IPS: N.A.; PartId: 100500475; Component Class: Connectors
TP10 = TP_SMD: 1.0mm circular SMD testpad; Part Number: TP_SMD_Ø1.0MM; Manufacturer: Nordic Semiconductor; Manufacturer Part Number: N.A.; Value: Ø1.0mm,SMD; Pad Count: 1; ComponentLink1URL: N.A.; ComponentLink1Description: Datasheet; ComponentLink2URL: N.A.; ComponentLink2Description: Supplier link; HelpURL: N.A.; Footprint Doc: TP_SMD_Ø1.0mm; LatestRevisionDate: 2013-06-11; Published: 2013-06-11; Note: N.A.; Supplier 1: N.A.; Supplier Part Number 1: N.A.; Supplier 2: N.A.; Supplier Part Number 2: N.A.; Artikkelnr Noca: N.A.; Part number IPS: N.A.; PartId: 100500475; Component Class: Connectors
U1 = IC_USB_UART: USB Bridge, USB to UART USB 2.0 UART Interface 12-DFN (3x3); Manufacturer_Name: FTDI Chip; Datasheet Link: https://componentsearchengine.com/Datasheets/2/FT234XD-R.pdf; Height: 0.75mm; Supplier 1: Digi-Key; Supplier Part Number 1: 768-1178-1-ND; Unit Price: 2.24
U2 = MCU_nRF9160-SICAB1A: Low power System-in-Package with integrated LTE-M/NB-IoT modem and GPS; Manufacturer_Name: Nordic Semiconductor; Manufacturer Part Number: nRF9160-SICAB1A; Value: nRF9160-SICAB1A; ComponentLink1URL: N.A.; ComponentLink1Description: Datasheet; ComponentLink2URL: N.A.; ComponentLink2Description: Supplier link; Supplier 1: Digi-Key; Supplier Part Number 1: 1490-NRF9160-SICA-B1A-R7CT-ND; Unit Price: 31.40
U3 = NX3DV2567GU: Low-ohmic four-pole double-throw analog switch; Manufacturer_Name: NXP Semiconductors; Manufacturer Part Number: NX3DV2567GU; Value: NX3DV2567; ComponentLink1URL: N.A.; ComponentLink1Description: Datasheet; ComponentLink2URL: N.A.; ComponentLink2Description: Supplier link; Supplier 1: Mouser; Supplier Part Number 1: 771-NX3DV2567GU115; Unit Price: 0.92
U4 = M2M_UICC: M2M UICC SIM Card; Manufacturer: N.A.; Pad Count: 8; Part Number: M2M_UICC; Manufacturer Part Number: N.A.; Value: M2M UICC; Footprint Doc: SON-8; Artikkelnr Noca: N.A.; ComponentLink1Description: Datasheet; ComponentLink1URL: N.A.; ComponentLink2Description: Supplier link; ComponentLink2URL: N.A.; HelpURL: N.A.; LatestRevisionDate: 2019-10-22; Note: N.A.; Part number IPS: N.A.; Published: 2019-10-22; Supplier 1: N.A.; Supplier 2: N.A.; Supplier Part Number 1: N.A.; Supplier Part Number 2: N.A.; PartId: 101900595; Component Class: Misc_ICs
Y1-Y6 = SHUNT JUMPER 2.54mm BLACK GOLD Horizontal: Shunt Jumper 2.54mm Black; Manufacturer Part Number: SPC02SYAN; Manufacturer_Name: Sullins Connector Solutions; ComponentLink1URL: N.A.; ComponentLink1Description: Datasheet; ComponentLink2URL: N.A.; ComponentLink2Description: Supplier link; Footprint Doc: SHUNT JUMPER 2.54mm; Value: Shunt 2.54mm; Component Class: Connectors; Supplier 1: Digi-Key; Supplier Part Number 1: S9001-ND; Unit Price: 0.10